# EAGLE design driver (EAGLE 6.2)
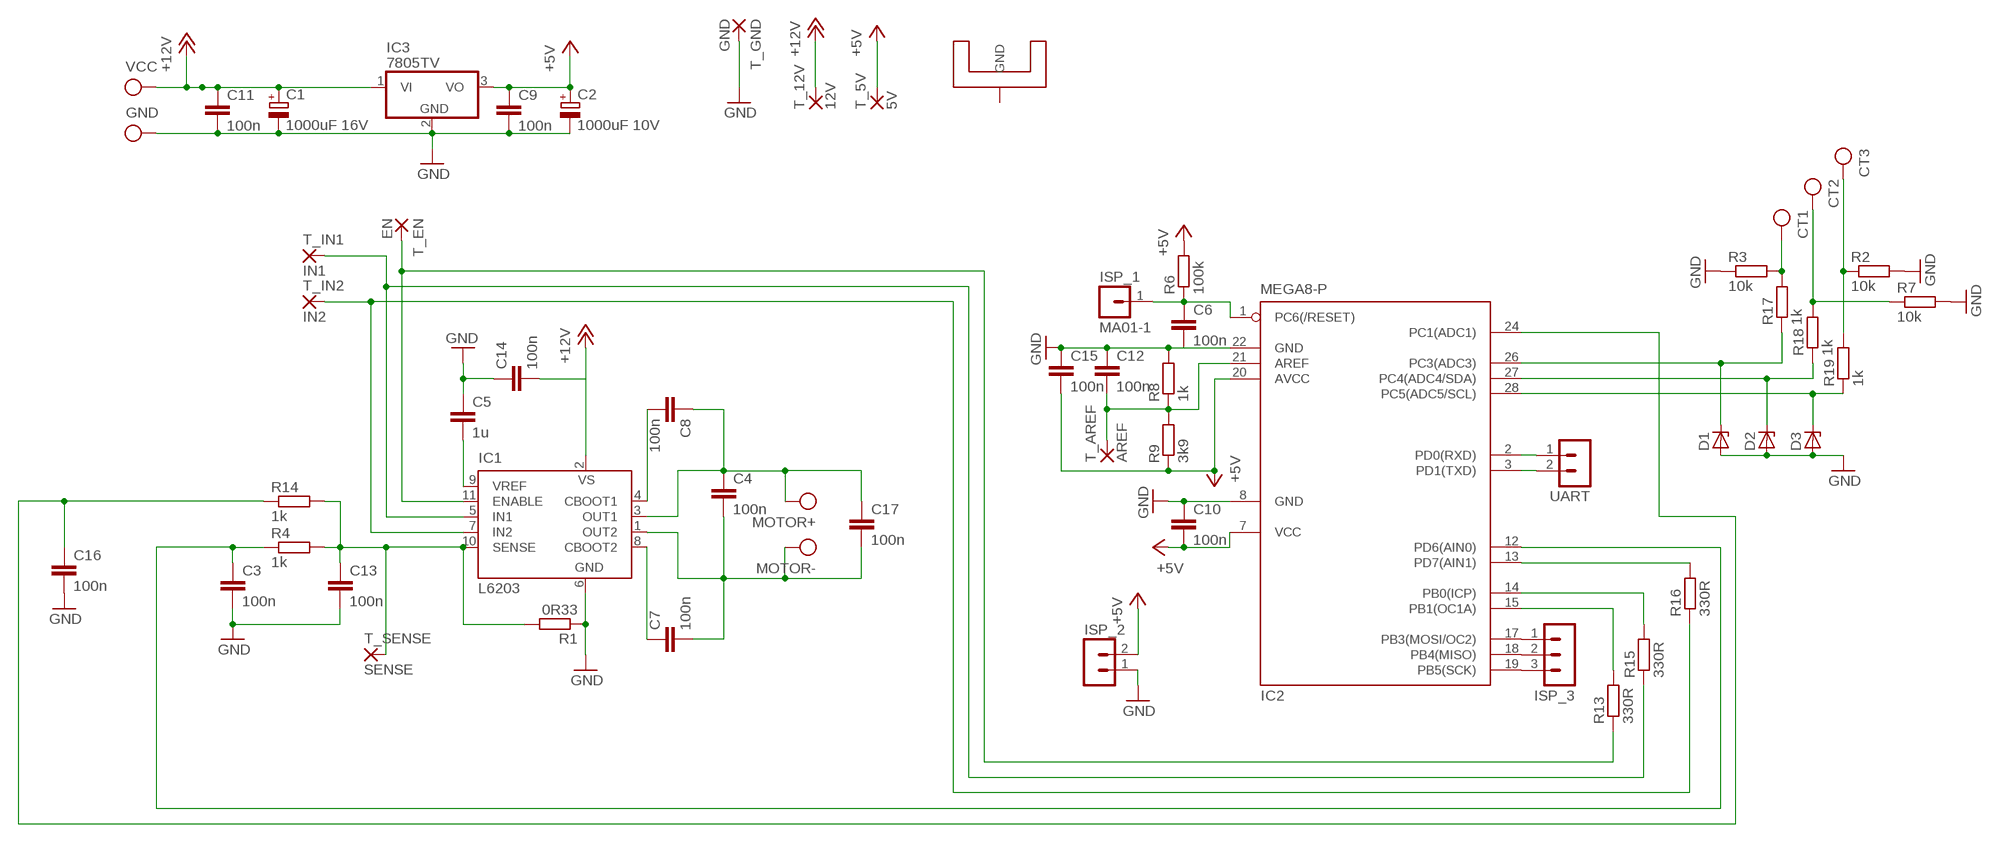
[diagram p0: schematic, sheet 1]

## Parts
C1  1000uF 16V  CPOL-EUE5-10.5  [E5-10,5]
C2  1000uF 10V  CPOL-EUE5-10.5  [E5-10,5]
C3  100n  C-EUC0805K  [C0805K]
C4  100n  C-EU050-024X044  [C050-024X044]
C5  1u  C-EUC0805K  [C0805K]
C6  100n  C-EUC0805K  [C0805K]
C7  100n  C-EU075-032X103  [C075-032X103]
C8  100n  C-EUC0805K  [C0805K]
C9  100n  C-EUC0805K  [C0805K]
C10  100n  C-EUC0805K  [C0805K]
C11  100n  C-EUC0805K  [C0805K]
C12  100n  C-EUC0805K  [C0805K]
C13  100n  C-EUC0805K  [C0805K]
C14  100n  C-EUC0805K  [C0805K]
C15  100n  C-EUC0805K  [C0805K]
C16  100n  C-EUC0805K  [C0805K]
C17  100n  C-EUC0805K  [C0805K]
CT1  PIN_X  [PIN_X]
CT2  PIN_X  [PIN_X]
CT3  PIN_X  [PIN_X]
D1  ZENER-DIODESOD80C  [SOD80C]
D2  ZENER-DIODESOD80C  [SOD80C]
D3  ZENER-DIODESOD80C  [SOD80C]
GND  PIN_X  [PIN_X]
IC1  L6203  [MULTIWATT-11]
IC2  MEGA8-P  [DIL28-3]
IC3  7805TV  [TO220V]
ISP_1  MA01-1  [MA01-1]
ISP_2  MA02-1  [MA02-1]
ISP_3  MA03-1  [MA03-1]
MOTOR+  PIN_X  [PIN_X]
MOTOR-  PIN_X  [PIN_X]
R1  0R33  R-EU_0922/22  [0922/22]
R2  10k  R-EU_R0805W  [R0805W]
R3  10k  R-EU_R0805W  [R0805W]
R4  1k  R-EU_R0805W  [R0805W]
R6  100k  R-EU_R0805W  [R0805W]
R7  10k  R-EU_R0805W  [R0805W]
R8  1k  R-EU_R0805W  [R0805W]
R9  3k9  R-EU_R0805W  [R0805W]
R13  330R  R-EU_0207/12  [0207/12]
R14  1k  R-EU_R0805W  [R0805W]
R15  330R  R-EU_R0805W  [R0805W]
R16  330R  R-EU_R0805W  [R0805W]
R17  1k  R-EU_R0805W  [R0805W]
R18  1k  R-EU_R0805W  [R0805W]
R19  1k  R-EU_R0805W  [R0805W]
T_5V  5V  2,15/1,0  [2,15/1,0]
T_12V  12V  2,15/1,0  [2,15/1,0]
T_AREF  AREF  2,15/1,0  [2,15/1,0]
T_EN  EN  2,15/1,0  [2,15/1,0]
T_GND  GND  2,15/1,0  [2,15/1,0]
T_IN1  IN1  2,15/1,0  [2,15/1,0]
T_IN2  IN2  2,15/1,0  [2,15/1,0]
T_SENSE  SENSE  2,15/1,0  [2,15/1,0]
U$1  HEATSINK_CAR_ANTENNA  [HEATSINK_CAR_ANTENNA]
UART  MA02-1  [MA02-1]
VCC  VCC  PIN_X  [PIN_X]

## Nets
+5V: C2.+ C9.1 C10.2 C15.2 IC2.7(VCC) IC2.20(AVCC) IC3.3(VO) ISP_2.2 R6.2 R9.1 T_5V.1(P)
+12V: C1.+ C11.1 C14.2 IC1.2(VS) IC3.1(VI) T_12V.1(P) VCC.P$7(P)
GND: C1.- C2.- C3.2 C5.1 C6.2 C9.2 C10.1 C11.2 C12.1 C13.2 C14.1 C15.1 C16.2 D1.A D2.A D3.A GND.P$7(P) IC1.6(GND) IC2.8(GND) IC2.22(GND) IC3.2(GND) ISP_2.1 R1.1 R2.2 R3.1 R7.2 R8.2 T_GND.1(P)
N$1: CT3.P$7(P) R2.1 R19.2
N$2: CT1.P$7(P) R3.2 R17.2
N$3: C4.1 C8.1 C17.1 IC1.3(OUT1) MOTOR+.P$7(P)
N$4: C7.1 IC1.8(CBOOT2)
N$5: CT2.P$7(P) R7.1 R18.2
N$6: D1.C IC2.26(PC3(ADC3)) R17.1
N$7: C13.1 IC1.10(SENSE) R1.2 R4.2 R14.2 T_SENSE.1(P)
N$8: C8.2 IC1.4(CBOOT1)
N$9: C5.2 IC1.9(VREF)
N$10: C4.2 C7.2 C17.2 IC1.1(OUT2) MOTOR-.P$7(P)
N$11: C3.1 IC2.12(PD6(AIN0)) R4.1
N$12: IC1.7(IN2) R16.1 T_IN2.1(P)
N$13: IC1.11(ENABLE) R13.1 T_EN.1(P)
N$14: IC1.5(IN1) R15.1 T_IN1.1(P)
N$15: IC2.15(PB1(OC1A)) R13.2
N$16: IC2.17(PB3(MOSI/OC2)) ISP_3.1
N$17: IC2.18(PB4(MISO)) ISP_3.2
N$18: C12.2 IC2.21(AREF) R8.1 R9.2 T_AREF.1(P)
N$19: IC2.19(PB5(SCK)) ISP_3.3
N$20: IC2.2(PD0(RXD)) UART.1
N$21: IC2.3(PD1(TXD)) UART.2
N$23: C16.1 IC2.24(PC1(ADC1)) R14.1
N$24: IC2.14(PB0(ICP)) R15.2
N$25: IC2.13(PD7(AIN1)) R16.2
N$27: C6.1 IC2.1(PC6(/RESET)) ISP_1.1 R6.1
N$28: D2.C IC2.27(PC4(ADC4/SDA)) R18.1
N$30: D3.C IC2.28(PC5(ADC5/SCL)) R19.1

## Power pins joined to a net without a drawn wire
GND: U$1.CENTER(GND) U$1.LEFT(GND) U$1.RIGHT(GND)

## Library data of the parts
C1 C2 = resistor:CPOL-EU: POLARIZED CAPACITOR, European symbol
C3-C17 = resistor:C-EU: CAPACITOR, European symbol
CT1-CT3 GND MOTOR+ MOTOR- VCC = _my_lib:PIN_X
D1-D3 = diode:ZENER-DIODE: Z-Diode
IC1 = st-microelectronics:L6203: DMOS FULL BRIDGE DRIVER; MPN: L6203; OC_FARNELL: 1467715; OC_NEWARK: 56P8434
IC2 = _my_lib:MEGA8-P: MICROCONTROLLER 8 Kbytes FLASH, 1 kbytes SRAM, 512 bytes EEPROM, USART, 4-channel 10 bit ADC, 2-channel 8 bit ADC Pin compatible with Atmega48, ATMega88, ATMega168 Source: avr.lbr; OC_FARNELL: unknown; OC_NEWARK: unknown
IC3 = linear:78*: Positive VOLTAGE REGULATOR Source: http://cache.national.com/ds/LM/LM78L05.pdf http://www.fairchildsemi.com/ds/LM/LM7805.pdf
ISP_1 = con-lstb:MA01-1
ISP_2 UART = con-lstb:MA02-1: PIN HEADER
ISP_3 = con-lstb:MA03-1: PIN HEADER; OC_FARNELL: unknown; OC_NEWARK: unknown
R1-R4 R6-R9 R13-R19 = resistor:R-EU_: RESISTOR, European symbol
T_5V T_12V T_AREF T_EN T_GND T_IN1 T_IN2 T_SENSE = wirepad:2,15/1,0: THROUGH-HOLE PAD
U$1 = _my_lib:HEATSINK_CAR_ANTENNA

## Board
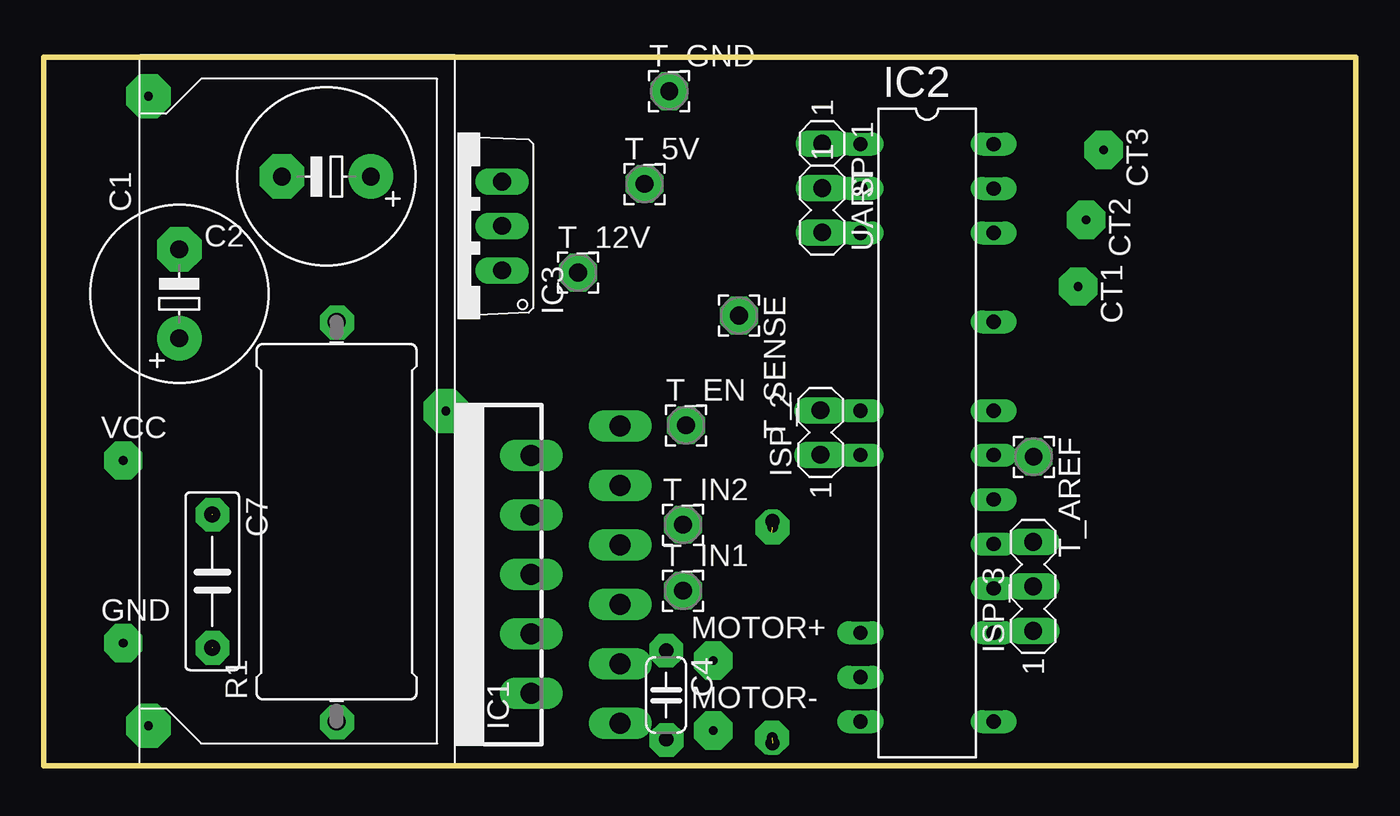
[diagram p1: board, top side]
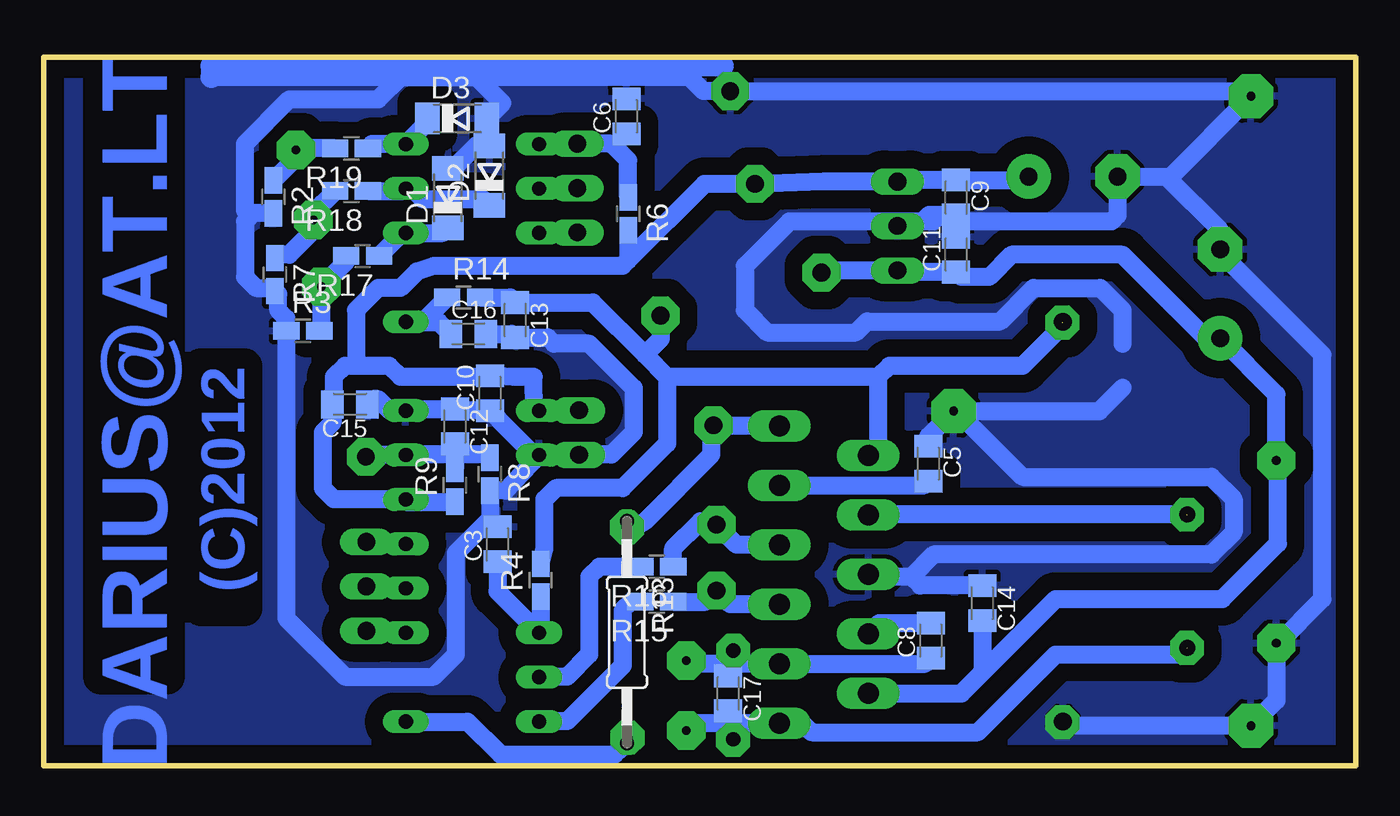
[diagram p2: board, bottom side, seen from below]

Size 75 x 40.5 mm. Coordinates in mm from the lower left corner, seen from the top.
Outline: 0,0 75,0 75,40.5 0,40.5 0,0
Copper layers (1*16): Top 0.035mm / dielectric 1.5mm / Bottom 0.035mm
Design rules: minimum track width 10mil, minimum drill 24mil, track to track 8mil, track to pad 8mil, pad to pad 8mil, via to via 8mil, smd to smd 8mil, copper to edge 40mil, drill to drill 8mil, minimum pad ring 10mil, minimum via ring 8mil, stop-mask expansion 4mil, vias tented up to drill 0mil, thermal gap 10mil

### Footprints (pad centres in the part's own frame; a part is rotated, then mirrored left to right if it is on the bottom)
E5-10,5 = drill 1.016 pad 2.54: + -2.54,0 | drill 1.016 pad 2.54 octagon: - 2.54,0
C0805K = smd 1.3 x 1.6: 1 -1,0; 2 1,0
C050-024X044 = drill 0.813 octagon: 1 -2.54,0; 2 2.54,0
C075-032X103 = drill 0.914 octagon: 1 -3.81,0; 2 3.81,0
PIN_X = drill 0.5 pad 2.184 octagon: P$7 0,0
SOD80C = smd 1.4 x 1.8: A 1.7,0; C -1.7,0
MULTIWATT-11 = drill 1.2 long: 1 -8.5,-6.35; 2 -6.8,-1.27; 3 -5.1,-6.35; 4 -3.4,-1.27; 5 -1.7,-6.35; 6 0,-1.27; 7 1.7,-6.35; 8 3.4,-1.27; 9 5.1,-6.35; 10 6.8,-1.27; 11 8.5,-6.35
DIL28-3 = drill 0.813 long: 1 -16.51,-3.81; 2 -13.97,-3.81; 3 -11.43,-3.81; 7 -1.27,-3.81; 8 1.27,-3.81; 12 11.43,-3.81; 13 13.97,-3.81; 14 16.51,-3.81; 15 16.51,3.81; 17 11.43,3.81; 18 8.89,3.81; 19 6.35,3.81; 20 3.81,3.81; 21 1.27,3.81; 22 -1.27,3.81; 24 -6.35,3.81; 26 -11.43,3.81; 27 -13.97,3.81; 28 -16.51,3.81
TO220V = drill 1.016 long: 1 -2.54,-2.54; 2 0,-2.54; 3 2.54,-2.54
MA01-1 = drill 1.016 long: 1 0,0
MA02-1 = drill 1.016 long: 1 0,0; 2 2.54,0
MA03-1 = drill 1.016 long: 1 -2.54,0; 2 0,0; 3 2.54,0
0922/22 = drill 1.016 octagon: 1 -11.43,0; 2 11.43,0
R0805W = smd 1.5 x 1: 1 -0.94,0; 2 0.94,0
0207/12 = drill 0.813 octagon: 1 -6.35,0; 2 6.35,0
2,15/1,0 = drill 1.016 pad 2.159 octagon: 1 0,0
HEATSINK_CAR_ANTENNA = drill 0.5 pad 2.54 octagon: CENTER 0,0; LEFT -18,17; RIGHT 18,17

### Placement (x,y rotation side)
C1  7.75,26.98 90 top
C2  16.16,33.68 180 top
C3  49.06,12.65 90 bottom
C4  35.58,4.04 270 top
C5  24.44,17.26 270 bottom
C6  41.69,37.12 90 bottom
C7  9.63,10.54 270 top
C8  24.3,7.14 90 bottom
C9  22.84,32.49 270 bottom
C10  49.49,21.3 90 bottom
C11  22.85,29.22 90 bottom
C12  51.49,19.39 270 bottom
C13  48.05,25.48 270 bottom
C14  21.35,9.29 270 bottom
C15  57.49,20.66 180 bottom
C16  50.73,24.68 0 bottom
C17  35.88,4.13 270 bottom
CT1  59.13,27.39 270 top
CT2  59.59,31.2 270 top
CT3  60.59,35.2 270 top
D1  51.89,32.46 90 bottom
D2  49.52,33.73 90 bottom
D3  51.36,37 0 bottom
GND  4.54,7 0 top
IC1  26.6,10.93 90 top
IC2  50.49,19.02 270 top
IC3  23.66,30.86 90 top
ISP_1  44.49,35.56 270 top
ISP_2  44.41,17.77 90 top
ISP_3  56.56,10.24 90 top
MOTOR+  38.27,6 0 top
MOTOR-  38.27,2 0 top
R1  16.74,13.95 90 top
R2  61.88,32.52 270 bottom
R3  60.19,24.86 0 bottom
R4  46.6,10.6 90 bottom
R6  41.59,31.55 270 bottom
R7  61.78,28.07 270 bottom
R8  49.49,16.66 270 bottom
R9  51.49,16.02 90 bottom
R13  41.66,7.63 270 bottom
R14  51,26.77 0 bottom
R15  39.95,9.38 180 bottom
R16  39.95,11.38 180 bottom
R17  56.77,29.14 180 bottom
R18  57.41,32.85 180 bottom
R19  57.41,35.3 180 bottom
T_5V  34.35,33.26 0 top
T_12V  30.54,28.19 0 top
T_AREF  56.59,17.66 270 top
T_EN  36.72,19.46 0 top
T_GND  35.76,38.56 0 top
T_IN1  36.54,10 0 top
T_IN2  36.54,13.77 0 top
T_SENSE  39.74,25.73 270 top
U$1  22.99,20.27 90 top
UART  44.49,33.02 270 top
VCC  4.54,17.45 0 top

### Tracks (layer width: path | path; a pad name or v marks a point on that pad's centre or on a via)
+5V
  Bottom 1.016: R9.1 54.3,15.09 IC2.20 54.33,15.24 58.42,15.24 59.05,15.88 59.05,19.05 58.49,19.61 C15.2 58.42,20.73 58.42,22.23 57.78,22.86 57.15,22.86 | 57.15,22.86 55.24,22.86 54.61,22.23 50.16,22.23 49.6,22.3 C10.2 48.16,22.23 46.99,22.23 46.97,20.3 IC2.7 46.66,20.32 ISP_2.2 | 57.15,22.86 57.15,26.04 55.88,27.3 54.61,27.3 53.66,28.25 52.71,28.57 41.91,28.57 41.59,28.89 | R6.2 41.59,28.89 | 41.59,28.89 37.23,33.26 T_5V.1 30.4,33.4 IC3.3 26.11,33.49 C9.1 18.89,33.49 C2.+
+12V
  Bottom 1.016: IC1.2 22.54,4.13 21.27,5.4 | 21.27,5.4 17.14,9.53 7.62,9.53 4.45,12.7 4.45,17.35 VCC.P$7 4.54,21.23 C1.+ 8.56,24.43 13.34,29.21 19.68,29.21 20.95,27.94 22.57,27.94 C11.1 26.11,28.22 IC3.1 30.41,28.32 T_12V.1 | C14.2 21.35,5.47 21.27,5.4
GND  (via drill 0.6 pad 1.93)
  Bottom 1.016: IC2.8 48.59,15.72 R8.2 49.49,14.09 | IC2.8 46.97,17.75 48.9,19.68 49.47,20.32 C10.1 50.14,20.3 50.8,20.32 51.42,20.32 C12.1 54.3,20.39 IC2.22 55.22,20.3 55.88,20.95 56.2,20.95 C15.1 | IC2.8 46.66,17.77 ISP_2.1 42.55,17.78 41.27,19.05 41.27,21.59 43.81,24.13 45.84,24.13 46.19,24.48 C13.2 48.25,24.68 C16.2 | 49.49,14.09 C3.2 | C9.2 24.39,31.49 24.77,31.11 25.94,31.11 IC3.2 | C9.2 C11.2 | R1.1 16.5,2.27 U$1.LEFT 4.54,3.72 GND.P$7 4.43,7 1.91,9.53 1.91,23.5 7.62,29.21 | 22.82,20.27 U$1.CENTER 24.44,18.82 C5.1 | 22.82,20.27 19.05,16.51 8.26,16.51 6.99,15.24 6.99,13.34 8.26,12.06 24.13,12.06 25.4,10.79 | 25.4,10.79 27.73,10.79 IC1.6 | C1.- 7.75,30.61 10.79,33.66 | 10.79,33.66 13.59,33.66 C2.- 13.62,31.47 13.97,31.11 22.47,31.11 C9.2 | 10.79,33.66 10.61,33.66 U$1.RIGHT 6.28,38.56 T_GND.1 37.3,38.56 38.1,39.37 | C14.1 24.9,10.29 25.4,10.79 | D1.A 51.56,34.16 50.16,35.56 49.66,35.56 | 49.66,35.56 D2.A | 49.49,14.09 51.44,12.15 51.44,6.35 52.7,5.08 57.78,5.08 61.13,8.43 R3.1 61.13,25.57 61.59,26.04 61.59,26.95 R7.2 61.95,27.3 62.87,27.3 63.5,27.94 63.5,31.11 63.03,31.58 R2.2 63.33,31.58 63.5,31.75 63.5,35.56 60.96,38.1 55.88,38.1 54.61,39.37 50.16,39.37 50.16,39.27 48.78,37.88 D3.A 49.66,35.56 | 38.1,39.37 38.73,40.01 44.57,40.01 | 38.1,39.37 65.41,39.37 | 24.13,31.11 32.38,31.11 34.92,28.57 34.92,26.04 33.66,24.77 28.57,24.77 27.94,25.4 20.32,25.4 18.41,27.3 14.61,27.3 13.34,26.04 13.34,24.13 | 22.82,20.27 14.65,20.27 13.34,21.59
  Bottom 1.27: 36.2,40.01 65.41,40.01 65.41,39.37
  other vias: 16.76,2.48
  pour Bottom (isolate 1.016): -3.17,42.55 79.38,42.55 79.38,-2.54 -3.17,-2.54
N$1
  Bottom 1.016: R19.2 60.49,35.3 CT3.P$7 60.59,34.74 R2.1
N$2
  Bottom 1.016: R17.2 57.72,28.8 CT1.P$7 59.13,24.98 R3.2
N$3
  Bottom 1.016: 35.56,5.83 IC1.3 24.61,5.83 C8.1 | 35.56,5.83 36.2,5.83 | 36.2,5.83 38.1,5.83 MOTOR+.P$7 | C4.1 35.58,5.85 35.56,5.83 | C17.1 35.88,5.51 36.2,5.83
N$4  (via drill 0.6 pad 1.93)  (1 unrouted)
  Bottom 1.016: C7.1 27.85,14.35 IC1.8
  other vias: 9.64,14.34
N$5
  Bottom 1.016: R7.1 61.59,29.21 60.96,29.21 59.59,30.58 CT2.P$7 59.59,31.61 R18.2
N$6
  Bottom 1.016: D1.C 52.2,30.45 IC2.26 54.52,30.45 R17.1
N$7  (via drill 0.6 pad 1.93)  (1 unrouted)
  Bottom 1.016: R14.2 48.33,26.77 C13.1 43.62,26.48 40.64,23.5 | 40.64,23.5 39.37,22.23 | 39.37,22.23 39.37,18.41 41.91,15.88 45.72,15.88 46.35,15.24 46.4,15.24 46.4,12.37 R4.2 | R1.2 17.17,24.74 19.05,22.86 26.67,22.86 27.3,22.23 | 27.3,22.23 27.3,18.3 IC1.10 | 27.3,22.23 39.37,22.23 | T_SENSE.1 39.74,24.39 40.64,23.5
  other vias: 16.76,25.34
N$8
  Bottom 1.016: 27.85,7.51 IC1.4 27.25,8.14 C8.2
N$9
  Bottom 1.016: IC1.9 24.67,16.03 C5.2
N$10  (via drill 0.6 pad 1.93)  (1 unrouted)
  Bottom 1.016: C7.2 10.02,6.35 17.14,6.35 21.59,1.91 31.11,1.91 31.64,2.43 IC1.1 35.56,2.43 | 35.56,2.43 36.2,2.43 | 36.2,2.43 37.84,2.43 MOTOR-.P$7 | C4.2 35.58,2.41 35.56,2.43 | C17.2 35.88,2.75 36.2,2.43
  other vias: 9.64,6.74
N$11
  Bottom 1.016: C3.1 49.06,9.97 IC2.12 | IC2.12 46.69,7.97 | R4.1 46.6,8.31 IC2.12
N$12
  Bottom 1.016: R16.1 39.02,12.42 37.47,13.97 36.74,13.97 T_IN2.1 35.4,12.63 IC1.7
N$13  (via drill 0.6 pad 1.93)  (1 unrouted)
  Bottom 1.016: IC1.11 36.69,19.43 T_EN.1 36.83,19.34 36.83,17.78 40.64,13.97 41.62,13.34 R13.1
  other vias: 41.66,13.62
N$14
  Bottom 1.016: IC1.5 35.77,9.23 T_IN1.1 37.16,9.38 R15.1
N$15  (via drill 0.6 pad 1.93)  (1 unrouted)
  Bottom 1.016: IC2.15 50.77,2.52 48.9,0.64 42.35,0.64 R13.2
  other vias: 41.63,1.6
N$16
  Bottom 1.016: IC2.17 56.45,7.59 ISP_3.1
N$17
  Bottom 1.016: IC2.18 56.45,10.13 ISP_3.2
N$18
  Bottom 1.016: C12.2 51.49,17.78 | 51.49,17.78 R9.2 | R8.1 49.49,17.78 51.49,17.78 | 51.49,17.78 54.28,17.78 IC2.21 56.49,17.75 T_AREF.1
N$19
  Bottom 1.016: IC2.19 56.45,12.68 ISP_3.3
N$20
  Bottom 1.016: UART.1 46.66,33.02 IC2.2
N$21
  Bottom 1.016: UART.2 46.66,30.48 IC2.3
N$23
  Bottom 1.016: IC2.24 53.34,25.38 | 53.34,25.38 52.42,25.38 C16.1 | R14.1 53.34,25.38
N$24
  Bottom 1.016: R15.2 41.42,9.38 41.91,8.89 41.91,5.71 45.09,2.54 46.66,2.54 IC2.14
N$25
  Bottom 1.016: R16.2 43.23,11.38 43.81,10.79 43.81,6.35 45.09,5.08 46.66,5.08 IC2.13
N$27
  Bottom 0.305: C6.1 41.69,35.78 42.23,35.24
  Bottom 1.016: IC2.1 46.66,35.56 ISP_1.1 42.55,35.56 42.23,35.24 41.59,34.6 R6.1
N$28
  Bottom 1.016: R18.1 54.45,32.85 IC2.27 53.95,32.99 53.34,32.38 49.88,32.38 D2.C
N$30
  Bottom 1.016: R19.1 56.23,35.53 IC2.28 53.06,36.78 D3.C
N$32  (via drill 0.6 pad 1.93)
  other vias: 35.58,6.57
N$33  (via drill 0.6 pad 1.93)
  other vias: 35.6,1.47

### Text on the board
Bottom: DARIUS@AT.LT | (C)2012